# Altium schematic sheet Fuente_Conn.SchDoc
size Letter
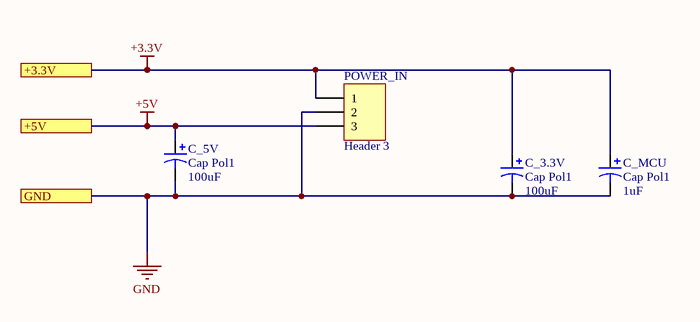
[diagram p0: Fuente_Conn.SchDoc]

## Parts
C_3.3V  Cap Pol1  value 100uF  [CAPR5-4X5]
C_5V  Cap Pol1  value 100uF  [CAPR5-4X5]
C_MCU  Cap Pol1  value 1uF  [CAPR5-4X5]
POWER_IN  Header 3  [HDR1X3]

## Ports
+3.3V, +5V, GND

## Nets
+3.3V: C_3.3V.1 C_MCU.1 POWER_IN.1 ; port +3.3V
+5V: C_5V.1 POWER_IN.3 ; port +5V
GND: C_3.3V.2 C_5V.2 C_MCU.2 POWER_IN.2 ; port GND

## Library data of the parts
C_3.3V C_5V C_MCU = Cap Pol1: Polarized Capacitor (Radial); Published: 8-Jun-2000; LatestRevisionDate: 17-Jul-2002; LatestRevisionNote: Re-released for DXP Platform.; PackageReference: RB7.6-15; Publisher: Altium Limited; PackageDescription: Polarized Capacitor (Radial); 2 Leads
POWER_IN = Header 3: Header, 3-Pin; LatestRevisionDate: 17-Jul-2002; LatestRevisionNote: Re-released for DXP Platform.; Publisher: Altium Limited